# EAGLE schematic MUXBreakout v8 (EAGLE 9.7.0)
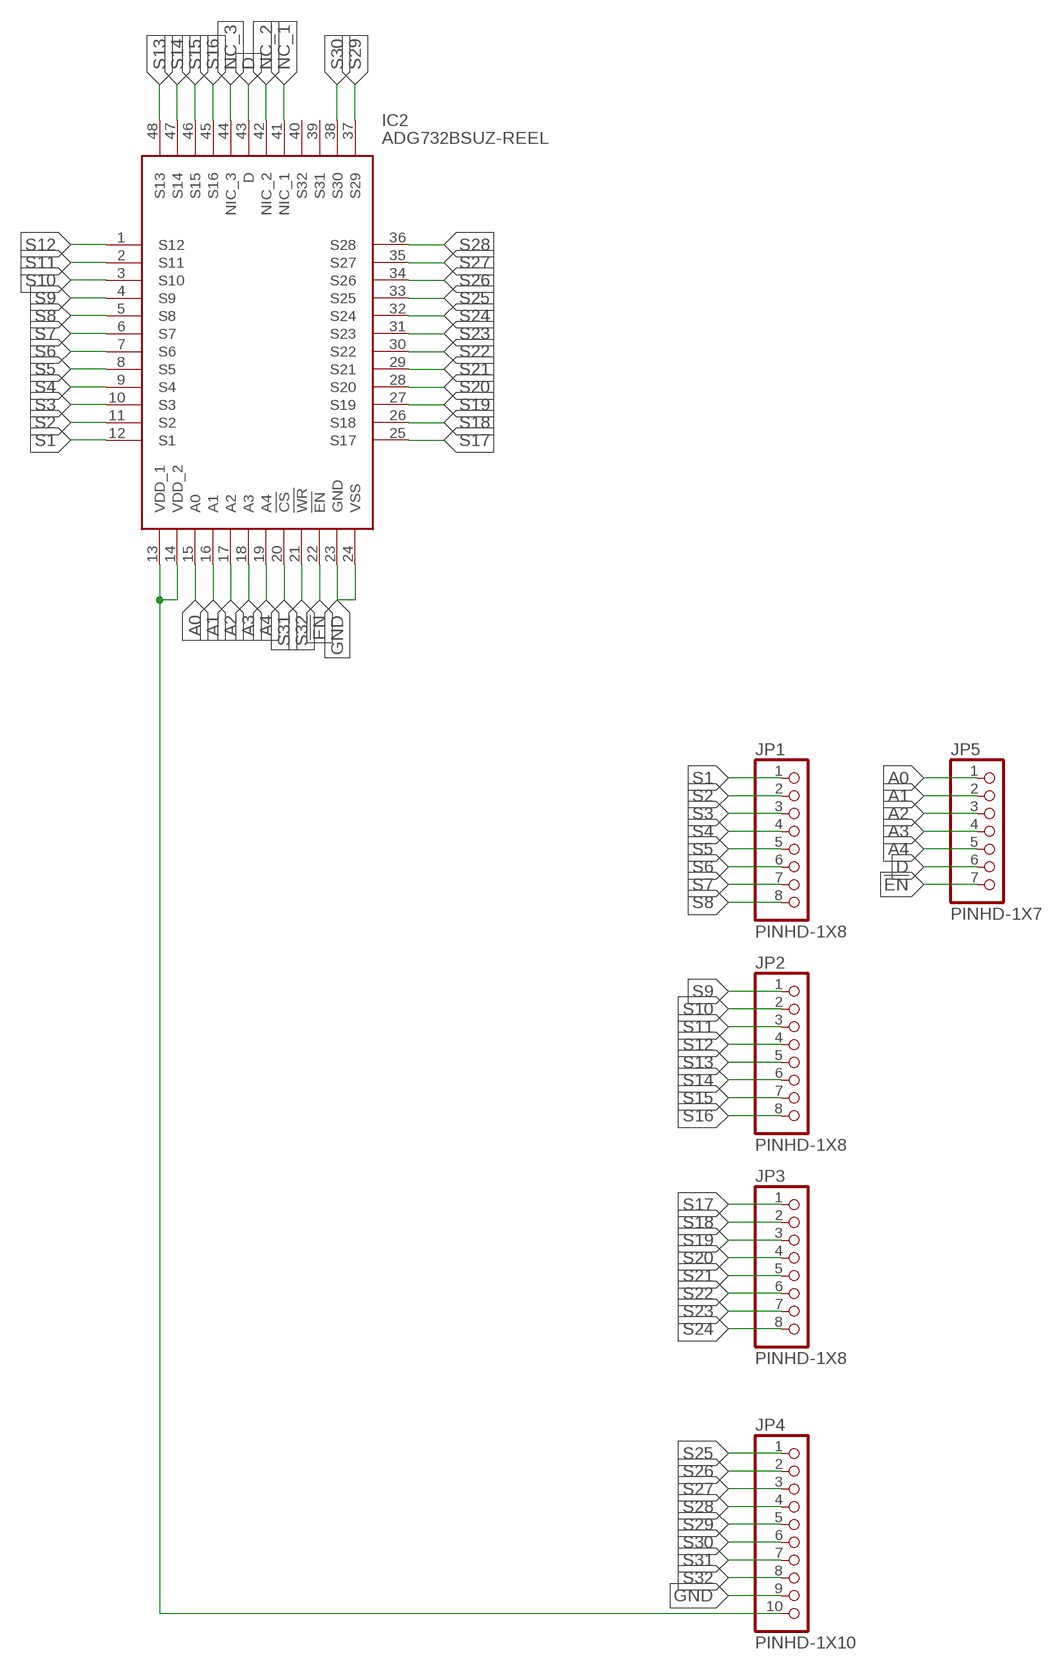
[diagram p0: schematic, sheet 1]

## Parts
IC2  ADG732BSUZ-REEL  [QFP50P900X900X120-48N]
JP1  PINHD-1X8  [1X08]
JP2  PINHD-1X8  [1X08]
JP3  PINHD-1X8  [1X08]
JP4  PINHD-1X10  [1X10]
JP5  PINHD-1X7  [1X07]

## Nets
!EN: IC2.22(!EN) JP5.7
A0: IC2.15(A0) JP5.1
A1: IC2.16(A1) JP5.2
A2: IC2.17(A2) JP5.3
A3: IC2.18(A3) JP5.4
A4: IC2.19(A4) JP5.5
D: IC2.43(D) JP5.6
GND: IC2.23(GND) IC2.24(VSS) JP4.9
NC_1: IC2.41(NIC_1)
NC_2: IC2.42(NIC_2)
NC_3: IC2.44(NIC_3)
S1: IC2.12(S1) JP1.1
S2: IC2.11(S2) JP1.2
S3: IC2.10(S3) JP1.3
S4: IC2.9(S4) JP1.4
S5: IC2.8(S5) JP1.5
S6: IC2.7(S6) JP1.6
S7: IC2.6(S7) JP1.7
S8: IC2.5(S8) JP1.8
S9: IC2.4(S9) JP2.1
S10: IC2.3(S10) JP2.2
S11: IC2.2(S11) JP2.3
S12: IC2.1(S12) JP2.4
S13: IC2.48(S13) JP2.5
S14: IC2.47(S14) JP2.6
S15: IC2.46(S15) JP2.7
S16: IC2.45(S16) JP2.8
S17: IC2.25(S17) JP3.1
S18: IC2.26(S18) JP3.2
S19: IC2.27(S19) JP3.3
S20: IC2.28(S20) JP3.4
S21: IC2.29(S21) JP3.5
S22: IC2.30(S22) JP3.6
S23: IC2.31(S23) JP3.7
S24: IC2.32(S24) JP3.8
S25: IC2.33(S25) JP4.1
S26: IC2.34(S26) JP4.2
S27: IC2.35(S27) JP4.3
S28: IC2.36(S28) JP4.4
S29: IC2.37(S29) JP4.5
S30: IC2.38(S30) JP4.6
S31: IC2.20(!CS) JP4.7
S32: IC2.21(!WR) JP4.8
VDD_2: IC2.13(VDD_1) IC2.14(VDD_2) JP4.10
Unconnected: IC2.39(S31) IC2.40(S32)

## Library data of the parts
IC2 = ADG732BSUZ-REEL:ADG732BSUZ-REEL: 16-/32-Channel, 4 , +1.8 V to +5.5 V and +/-2.5 V Analog Multiplexers. Source: Datasheet <https://componentsearchengine.com/Datasheets/1/ADG732BSUZ-REEL.pdf>; DESCRIPTION: 16-/32-Channel, 4 , +1.8 V to +5.5 V and +/-2.5 V Analog Multiplexers.; HEIGHT: 1.2mm; MANUFACTURER_NAME: Analog Devices; MANUFACTURER_PART_NUMBER: ADG732BSUZ-REEL; MOUSER_PART_NUMBER: 584-ADG732BSUZ-R; MOUSER_PRICE-STOCK: https://www.mouser.co.uk/ProductDetail/Analog-Devices/ADG732BSUZ-REEL?qs=BpaRKvA4VqGYLEdHjoL3%2FQ%3D%3D
JP1-JP3 = Connector:PINHD-1X8: PIN HEADER; CATEGORY: Headers; DESCRIPTION: Header, Straight, 8 Position; MANUFACTURER: Generic; MPN: Generic; OPERATING_TEMPERATURE: Generic; PART_STATUS: Active; PITCH: 0.100" (2.54mm); ROHS_COMPLIANCE: Generic; SERIES: Generic; SUB-CATEGORY: Headers, Male Pins; TYPE: Board to Board or Cable, Unshrouded, Through Hole, Straight
JP4 = Connector:PINHD-1X10: PIN HEADER; CATEGORY: Headers; DESCRIPTION: Header, Straight, 10 Position; MANUFACTURER: Generic; MPN: Generic; OPERATING_TEMPERATURE: Generic; PART_STATUS: Active; PITCH: 0.100" (2.54mm); ROHS_COMPLIANCE: Generic; SERIES: Generic; SUB-CATEGORY: Headers, Male Pins; TYPE: Board to Board or Cable, Unshrouded, Through Hole, Straight
JP5 = Connector:PINHD-1X7: PIN HEADER; CATEGORY: Headers; DESCRIPTION: Header, Straight, 7 Position; MANUFACTURER: Generic; MPN: Generic; OPERATING_TEMPERATURE: Generic; PART_STATUS: Active; PITCH: 0.100" (2.54mm); ROHS_COMPLIANCE: Generic; SERIES: Generic; SUB-CATEGORY: Headers, Male Pins; TYPE: Board to Board or Cable, Unshrouded, Through Hole, Straight